# EAGLE design ethero_v3 (EAGLE 6.4)
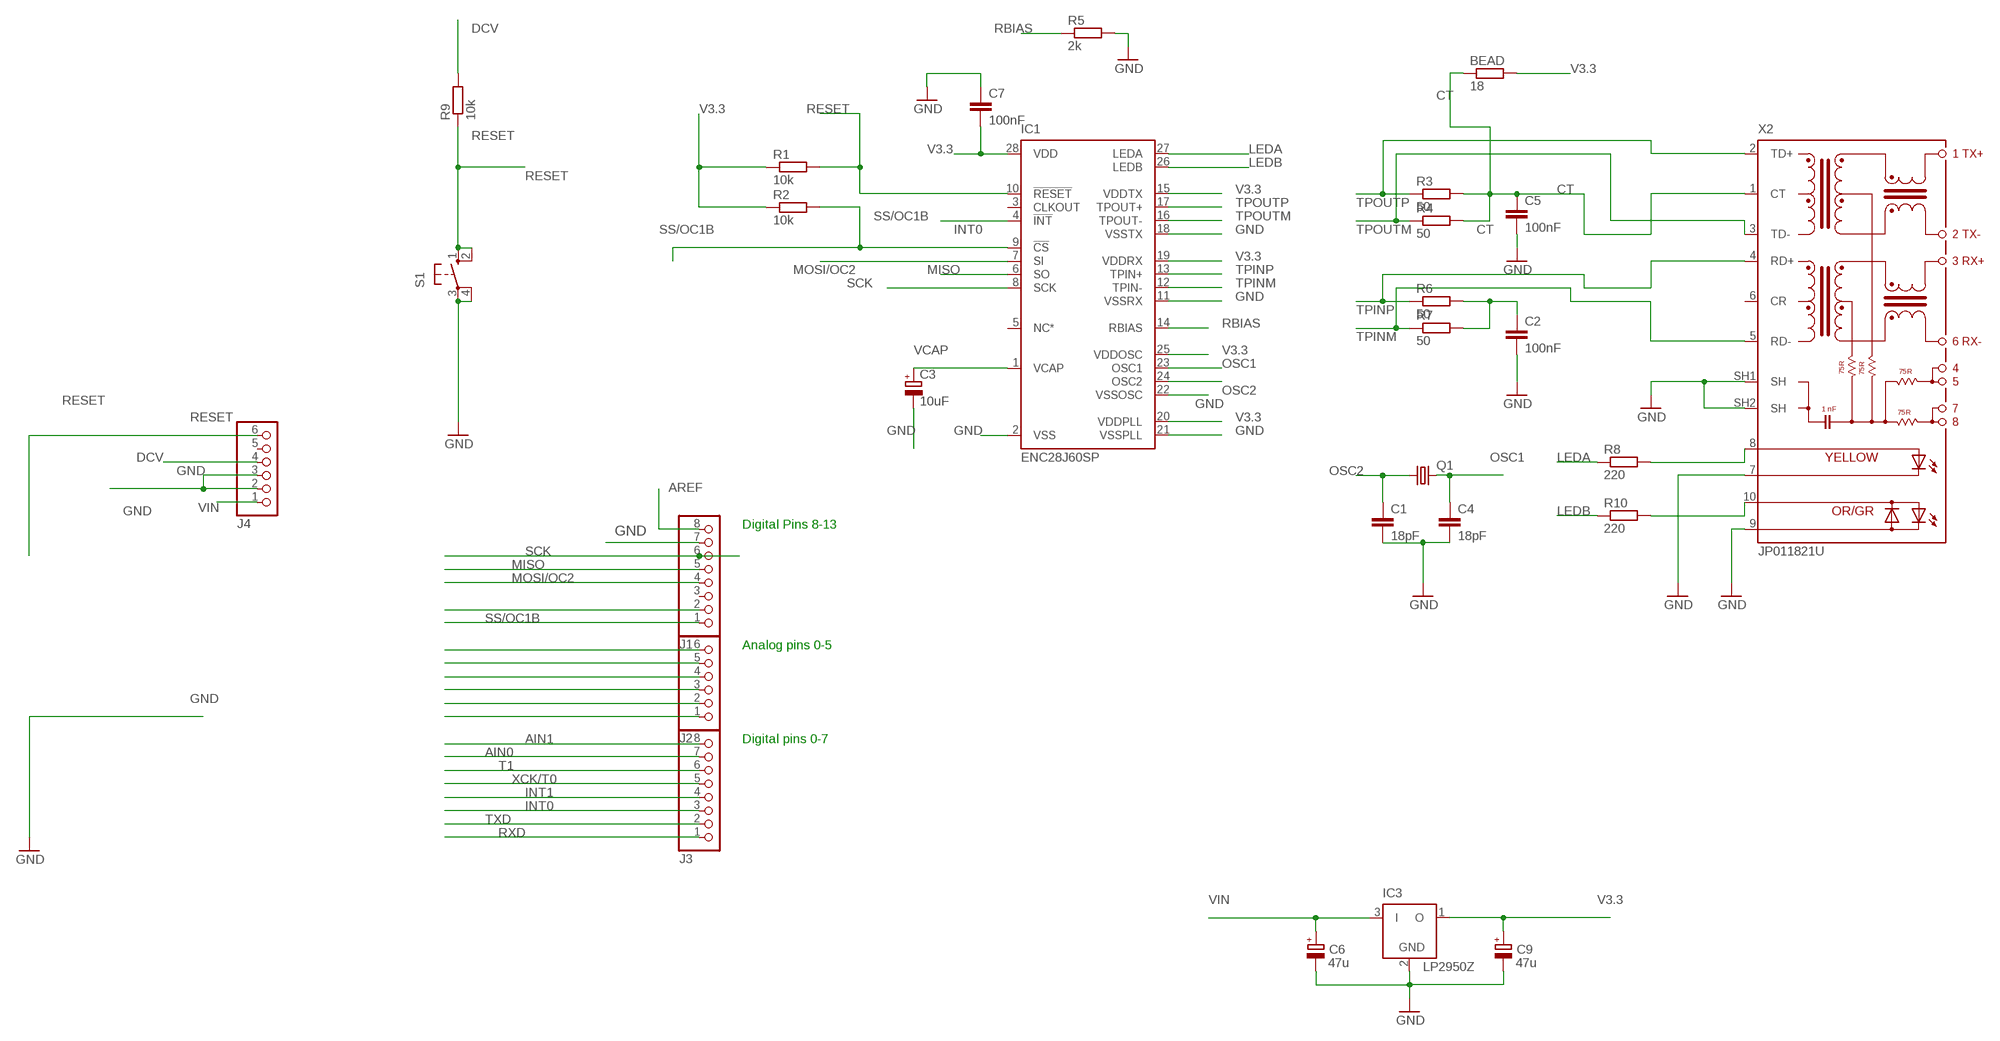
[diagram p0: schematic, sheet 1]

## Parts
BEAD  18  R-EU_0204/7  [0204/7]
C1  18pF  C-EU025-025X050  [C025-025X050]
C2  100nF  C-EU025-025X050  [C025-025X050]
C3  10uF  CPOL-EUE5-5  [E5-5]
C4  18pF  C-EU025-025X050  [C025-025X050]
C5  100nF  C-EU025-025X050  [C025-025X050]
C6  47u  CPOL-EUE3.5-8  [E3,5-8]
C7  100nF  C-EU025-025X050  [C025-025X050]
C9  47u  CPOL-EUE3.5-8  [E3,5-8]
IC1  ENC28J60SP  [DIL28-3]
IC3  LP2950Z  [TO92]
J1  PINHD-1X8  [1X08]
J2  PINHD-1X6  [1X06]
J3  PINHD-1X8  [1X08]
J4  PINHD-1X6  [1X06]
Q1  CRYSTALHC18U-V  [HC18U-V]
R1  10k  R-EU_0204/7  [0204/7]
R2  10k  R-EU_0204/7  [0204/7]
R3  50  R-EU_0204/7  [0204/7]
R4  50  R-EU_0204/7  [0204/7]
R5  2k  R-EU_0204/7  [0204/7]
R6  50  R-EU_0204/7  [0204/7]
R7  50  R-EU_0204/7  [0204/7]
R8  220  R-EU_0204/7  [0204/7]
R9  10k  R-EU_0204/7  [0204/7]
R10  220  R-EU_0204/7  [0204/7]
S1  10-XX  [B3F-10XX]
X2  JP011821U  [JP]

## Nets
AIN0: J3.7
AIN1: J3.8
AREF: J1.8
CT: BEAD.1 C5.1 R3.2 R4.2 X2.1(CT)
DCV [power]: J4.4 R9.2
GND [power]: C1.2 C2.2 C3.- C4.2 C5.2 C6.- C7.1 C9.- IC1.2(VSS) IC1.11(VSSRX) IC1.18(VSSTX) IC1.21(VSSPLL) IC1.22(VSSOSC) IC3.2(GND) J1.7 J4.2 J4.3 R5.2 S1.3(P) S1.4(P1) X2.7(C-Y) X2.9(A-O_C-G) X2.SH1(SH) X2.SH2(SH)
INT0: IC1.4(!INT) J3.3
INT1: J3.4
LEDA: IC1.27(LEDA) R8.1
LEDB: IC1.26(LEDB) R10.1
MISO: IC1.6(SO) J1.5
MOSI/OC2: IC1.7(SI) J1.4
N$2: J1.2
N$5: C2.1 R6.2 R7.2
N$10: R8.2 X2.8(A-Y)
N$12: R10.2 X2.10(C-O_A-G)
N$16: J2.1
N$17: J2.2
N$18: J2.3
N$19: J2.4
N$20: J2.5
N$21: J2.6
OSC1: C4.1 IC1.23(OSC1) Q1.2
OSC2: C1.1 IC1.24(OSC2) Q1.1
RBIAS: IC1.14(RBIAS) R5.1
RESET: IC1.10(!RESET) J4.6 R1.2 R9.1 S1.1(S) S1.2(S1)
RXD: J3.1
SCK: IC1.8(SCK) J1.6
SS/OC1B: IC1.9(!CS) J1.1 R2.2
T1: J3.6
TPINM: IC1.12(TPIN-) R7.1 X2.5(RD-)
TPINP: IC1.13(TPIN+) R6.1 X2.4(RD+)
TPOUTM: IC1.16(TPOUT-) R4.1 X2.3(TD-)
TPOUTP: IC1.17(TPOUT+) R3.1 X2.2(TD+)
TXD: J3.2
V3.3: BEAD.2 C7.2 C9.+ IC1.15(VDDTX) IC1.19(VDDRX) IC1.20(VDDPLL) IC1.25(VDDOSC) IC1.28(VDD) IC3.1(O) R1.1 R2.1
VCAP: C3.+ IC1.1(VCAP)
VIN [power]: C6.+ IC3.3(I) J4.1
XCK/T0: J3.5
Unconnected: IC1.3(CLKOUT) IC1.5(NC*) J1.3 J4.5 X2.6(CR)

## Notes on the sheet
- Digital Pins 8-13
- Analog pins 0-5
- Digital pins 0-7

## Library data of the parts
BEAD R1-R10 = resistor:R-EU_: RESISTOR, European symbol
C1 C2 C4 C5 C7 = resistor:C-EU: CAPACITOR, European symbol
C3 C6 C9 = rcl:CPOL-EU: POLARIZED CAPACITOR, European symbol
IC1 = microchip:ENC28J60: Stand-Alone Ethernet Controller with SPI Interface Source: http://ww1.microchip.com/downloads/en/DeviceDoc/39662c.pdf; MF: MICROCHIP; MPN: ENC28J60/SP; OC_FARNELL: 1084619; OC_NEWARK: 96K3661
IC3 = linear:LP2950: 100 mA, Low Power Low Dropout Voltage Regulator Source: http://www.onsemi.com/pub/Collateral/LP2950-D.PDF
J1 J3 = pinhead:PINHD-1X8: PIN HEADER
J2 J4 = pinhead:PINHD-1X6: PIN HEADER
Q1 = crystal:CRYSTAL: CRYSTAL; OC_FARNELL: unknown; OC_NEWARK: unknown
S1 = switch-omron:10-XX: OMRON SWITCH; MPN: B3F-1000; OC_FARNELL: 176432; OC_NEWARK: 36M3542
X2 = con-pulse:JP011821U: PULSEJACK (TM) 1x1 Tab-UP RJ45 10/100 Base-TX RJ45 1x1 Tab-UP with LEDs 8-pin (J1 series) and 6-pin (JP series) integrated magnetics connector, designed to support applications, such as ADSL modems, LAN-on-Motherboard, and Hub and Switches. Source: www.pulseeng.com .. PulseJack-J402.pdf; OC_FARNELL: unknown; OC_NEWARK: unknown

## Net classes
0 default: width 0.203 mm, clearance 0.203 mm
1 power: width 0.6 mm, clearance 0.305 mm
2 finepitch: width 0.203 mm, clearance 0.203 mm

## Board
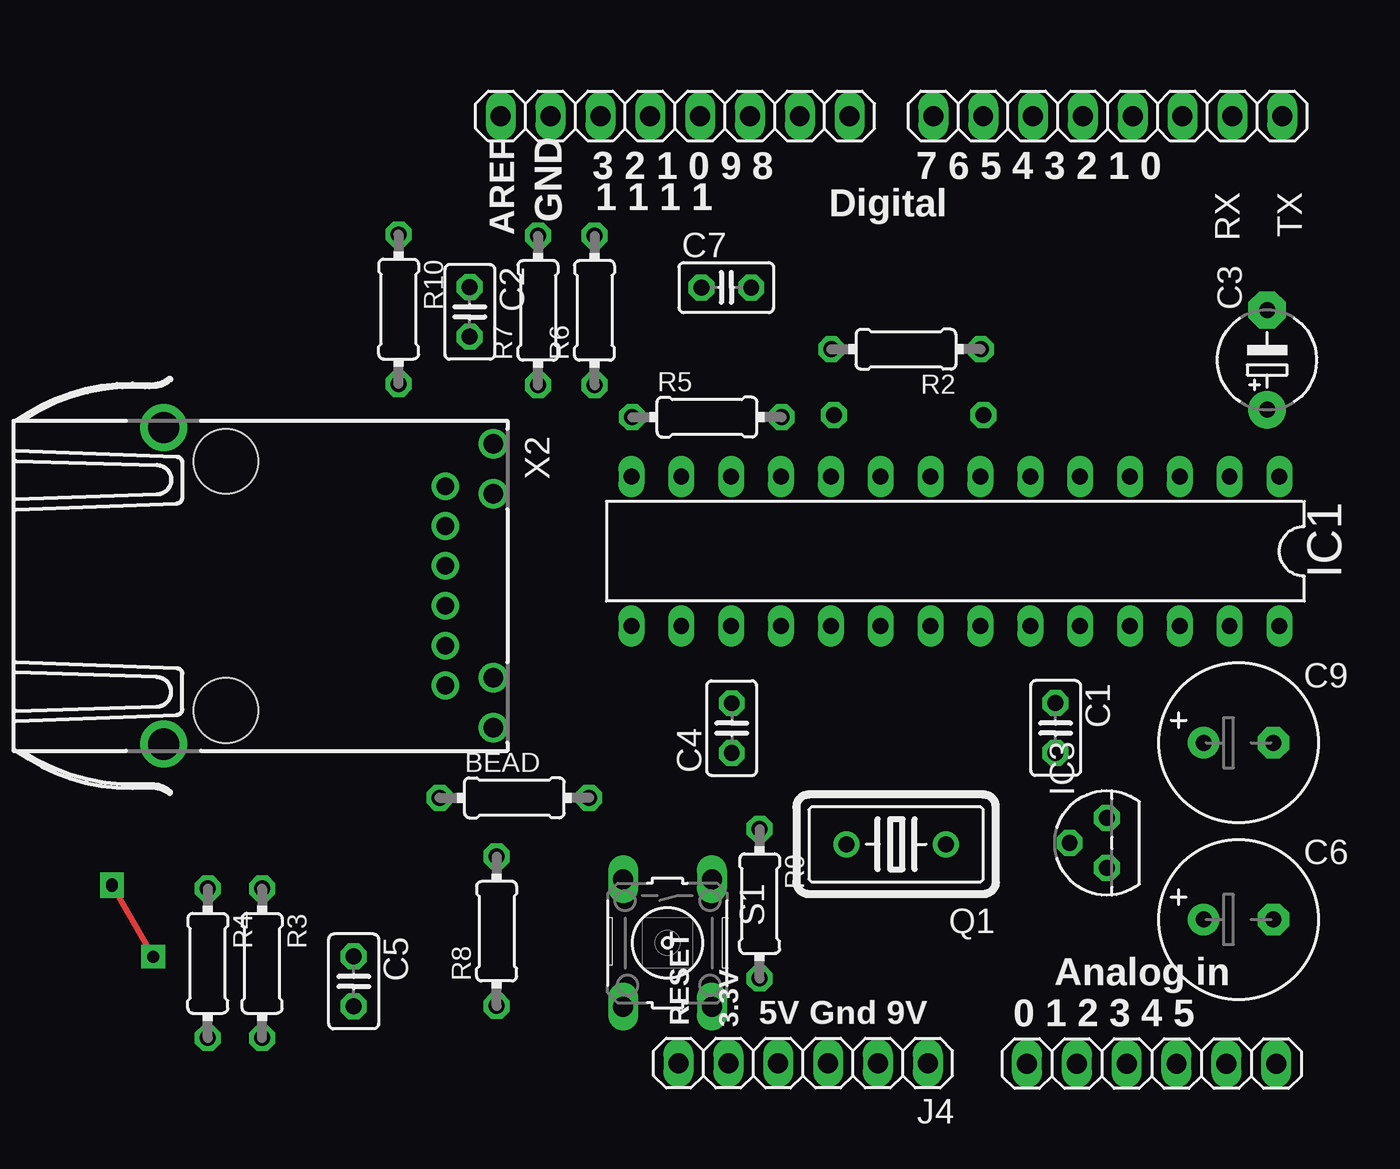
[diagram p1: board, top side]
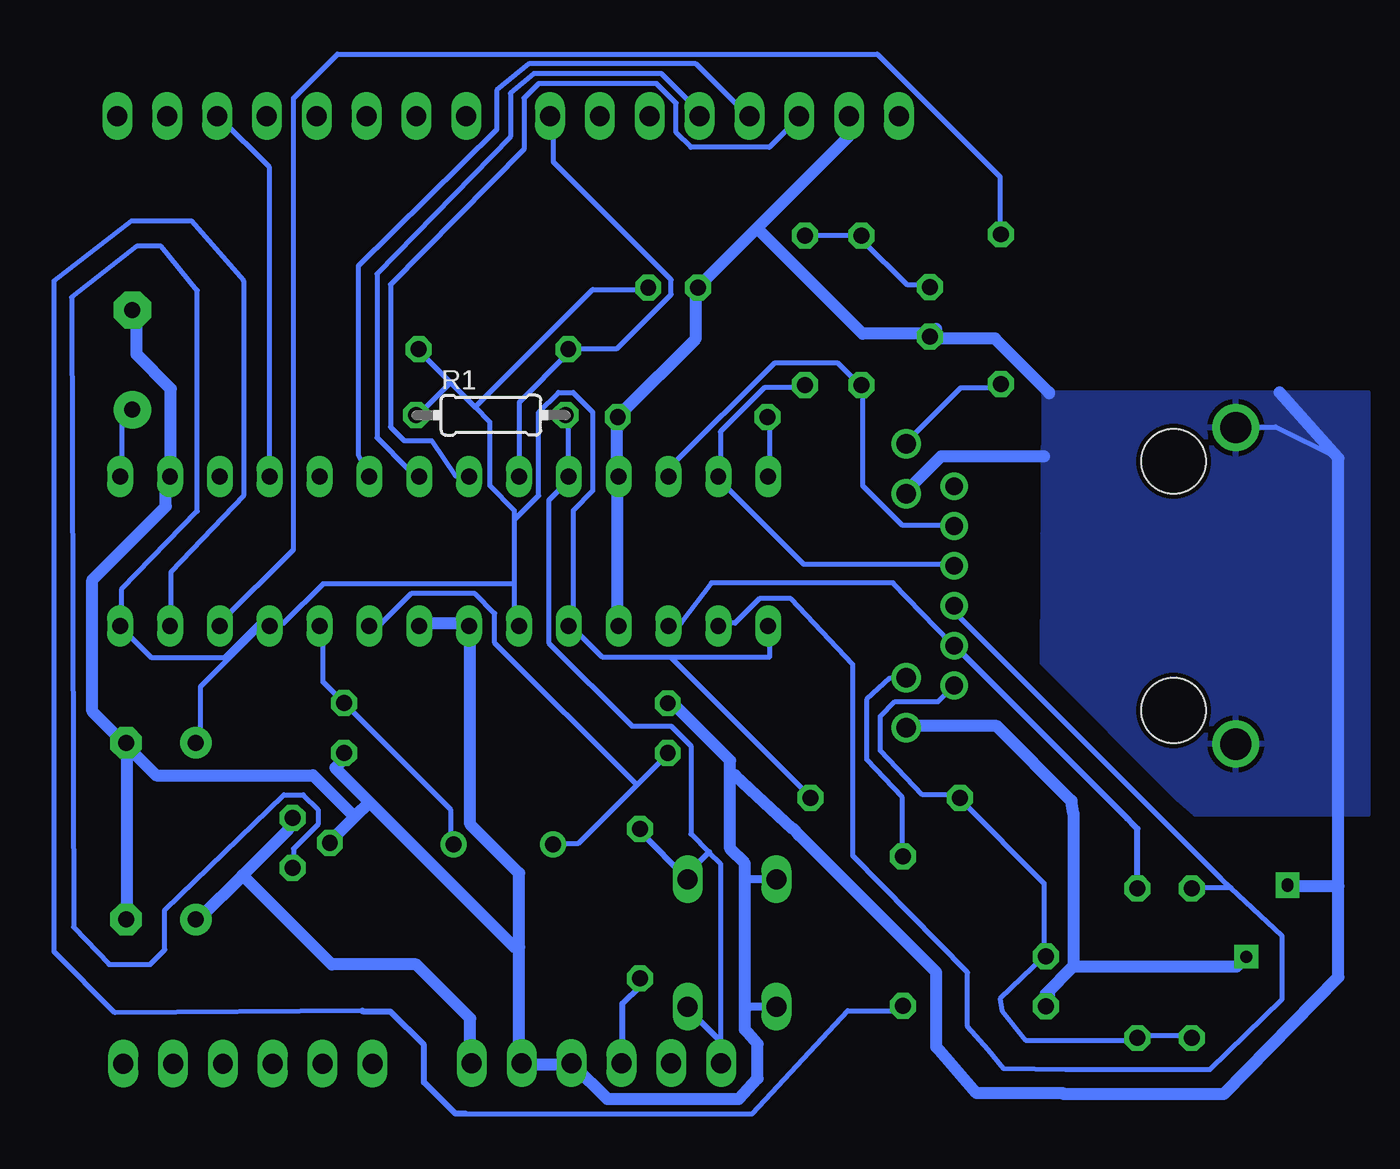
[diagram p2: board, bottom side, seen from below]

No outline drawn. Coordinates in mm, seen from the top.
Copper layers (1*16): Top 0.035mm / dielectric 1.5mm / Bottom 0.035mm
Design rules "default": minimum track width 10mil, minimum drill 0.6mm, track to track 8mil, track to pad 8mil, pad to pad 8mil, via to via 12mil, smd to smd 8mil, copper to edge 10mil, drill to drill 15mil, minimum pad ring 10mil, minimum via ring 12mil, stop-mask expansion 4mil, vias tented up to drill 0mil, thermal gap 10mil
tRestrict: area 13.4,48.9 to 17.2,52.7; area 64.2,33.6 to 68,37.4; area 64.2,5.7 to 68,9.5; 10 lines
bRestrict: area 13.4,48.9 to 17.2,52.7; area 64.2,33.6 to 68,37.4; area 64.2,5.7 to 68,9.5; 8 lines

### Footprints (pad centres in the part's own frame; a part is rotated, then mirrored left to right if it is on the bottom)
0204/7 = drill 0.813 octagon: 1 -3.81,0; 2 3.81,0
C025-025X050 = drill 0.813 octagon: 1 -1.27,0; 2 1.27,0
E5-5 = drill 0.813 pad 1.905: + -2.54,0 | drill 0.813 pad 1.905 octagon: - 2.54,0
E3,5-8 = drill 0.813 pad 1.6: + -1.778,0 | drill 0.813 pad 1.6 octagon: - 1.778,0
DIL28-3 = drill 0.813 long: 1 -16.51,-3.81; 2 -13.97,-3.81; 3 -11.43,-3.81; 4 -8.89,-3.81; 5 -6.35,-3.81; 6 -3.81,-3.81; 7 -1.27,-3.81; 8 1.27,-3.81; 9 3.81,-3.81; 10 6.35,-3.81; 11 8.89,-3.81; 12 11.43,-3.81; 13 13.97,-3.81; 14 16.51,-3.81; 15 16.51,3.81; 16 13.97,3.81; 17 11.43,3.81; 18 8.89,3.81; 19 6.35,3.81; 20 3.81,3.81; 21 1.27,3.81; 22 -1.27,3.81; 23 -3.81,3.81; 24 -6.35,3.81; 25 -8.89,3.81; 26 -11.43,3.81; 27 -13.97,3.81; 28 -16.51,3.81
TO92 = drill 0.813 octagon: 1 -1.27,0; 2 0,1.905; 3 1.27,0
1X08 = drill 1.016 long: 1 -8.89,0; 2 -6.35,0; 3 -3.81,0; 4 -1.27,0; 5 1.27,0; 6 3.81,0; 7 6.35,0; 8 8.89,0
1X06 = drill 1.016 long: 1 -6.35,0; 2 -3.81,0; 3 -1.27,0; 4 1.27,0; 5 3.81,0; 6 6.35,0
HC18U-V = drill 0.813: 1 -2.54,0; 2 2.54,0
B3F-10XX = drill 1.016 long: 1 -3.251,2.261; 2 3.251,2.261; 3 -3.251,-2.261; 4 3.251,-2.261
JP = drill 0.9 pad 1.3: 1 5.075,11.18; 2 3.045,11.18; 3 1.015,11.18; 4 -1.015,11.18; 5 -3.045,11.18; 6 -5.075,11.18 | drill 1 pad 1.4: 7 7.23,13.62; 8 4.69,13.62; 9 -4.69,13.62; 10 -7.23,13.62 | drill 1.6 pad 2.184: SH1 -8.065,-3.17; SH2 8.065,-3.17 | hole 3.3: 6.35,0; -6.35,0

### Placement (x,y rotation side)
BEAD  24.6,16.1 0 top
C1  52.18,19.65 270 top
C2  22.33,40.86 270 top
C3  62.96,38.41 90 top
C4  35.68,19.65 90 top
C5  16.41,6.74 270 top
C6  61.5,9.9 0 top
C7  35.4,42.1 0 top
C9  61.5,18.9 0 top
IC1  47.07,28.66 180 top
IC3  54.8,13.8 90 top
J1  32.79,50.84 180 top
J2  57.07,2.55 0 top
J3  54.84,50.84 180 top
J4  39.31,2.58 180 top
Q1  44.05,13.73 180 top
R1  44.69,35.6 0 bottom
R2  44.56,38.95 180 top
R3  11.74,7.67 270 top
R4  8.98,7.67 270 top
R5  34.41,35.5 0 top
R6  28.69,40.93 90 top
R7  25.81,40.93 90 top
R8  23.7,9.3 90 top
R9  37.1,10.7 270 top
R10  18.7,41 270 top
S1  32.4,8.7 270 top
X2  9.9,26.9 270 top

### Tracks (layer width: path | path; a pad name or v marks a point on that pad's centre or on a via)
CT
  Bottom 0.254: X2.1 21.25,21.75 21.15,21.75 21.9,21 24.1,21 24.85,20.25 24.85,18.5 22.7,16.25 21,16.25 BEAD.1 20.75,16 16.5,11.75 16.5,8.25 C5.1 16.5,8 18.75,5.85 18.65,5.25 17.45,3.75 11.75,3.75 R3.2 11.5,4 9,4 R4.2
DCV
  Bottom 0.305: R9.2 37.1,6.5 38,5.6 38,2.62 J4.4
GND  (via drill 0.6)
  Top 0.305: v4.1,11.6 v6.2,8
  Bottom 0.254: X2.SH1 5.74,34.97 5.7,35 4.7,35 1.5,33.4 | X2.7 22.07,19.67 22,19.6
  Bottom 0.406: S1.3 31.6,11.95 31.75,11.8 | S1.4 31.5,5.45 31.75,5.2
  Bottom 0.6: IC1.18 38.25,25 38.25,32.25 IC1.11 38.25,32.75 38.25,35.25 R5.2 38,35.75 34.25,39.5 34.25,42 C7.1 34,42.25 31.12,45.12 | 31.12,45.12 26.5,49.75 26.5,50.75 J1.7 | 15,15.3 15,7.5 16.25,6.25 16.25,5.5 C5.2 | C2.2 22.25,39.5 19,39.5 16.25,36.75 16.25,36.7 | 18.9,19.75 23.5,19.75 X2.7 | 16.5,33.5 21.75,33.5 23.5,31.75 X2.9 | 31.12,45.12 25.75,39.75 22.5,39.75 C2.2 | 61,32.5 IC1.2 | 61.25,32.25 IC1.2 | C1.2 52,18.25 52.62,17.62 50.88,15.88 | IC1.22 48.25,25 46,25 IC1.21 45.75,24.75 45.75,14.75 43.25,12.25 43.25,8.5 | 32.5,17.25 32.5,13.5 31.75,12.75 31.75,11.8 31.75,5.2 31.75,4.3 31.1,3.55 31.1,1.8 32.05,0.75 38.75,0.75 40.5,2.5 J4.3 40.75,2.5 43,2.5 J4.2 43.25,2.75 43.25,8.5 | 32.5,17.25 32.5,18 35.25,20.75 35.5,20.75 C4.2 | 50.88,15.88 43.5,8.5 43.25,8.5 | 32.5,17.25 32.25,17.25 29.35,14.55 29.25,14.5 29,14.2 22,7.2 22,3.4 19.95,1.05 15.55,1.05 15.5,1 7.35,1 1.5,6.95 1.5,11.6 1.5,33.4 4.5,36.75 | 22,40 22.25,39.75 C2.2 | 53,13.75 IC3.2 52.75,14 51.62,15.12 | 50.88,15.88 51.62,15.12 | 51.62,15.12 53.75,17.25 61.75,17.25 63.25,18.75 C9.- | C6.- 63.25,10 63.25,18.5 C9.- | IC1.2 61.25,32 61.25,30.95 65,27.2 65,20.5 63.5,19 C9.- | C3.- 62.75,40.75 62.75,38.7 61,36.95 61,32.75 IC1.2
  Bottom 0.61: 15,15.3 15.1,15.95 18.9,19.75 | C5.2 16.41,6.09 15,7.5 6.7,7.5 v6.2,8 | v4.1,11.6 1.5,11.6
  pour Bottom: 0,15.3 0,36.7 16.5,36.7 16.5,36.3 16.6,23 9.7,16.1 8.8,15.3
INT0
  Bottom 0.254: IC1.4 56,32.5 56,48.25 58.5,50.75 J3.3
LEDA
  Bottom 0.254: 46,0 31.35,0 26.5,5.25 23.75,5.25 R8.1 | 51.25,5.25 63.85,5.15 66.95,8.25 66.95,42.45 63,45.5 59.95,45.5 57.3,42.45 57.3,31.5 61,27.6 61,25 IC1.27
  Bottom 0.305: 46,0 46.5,0 48.1,1.6 48.1,3.5 49.8,5.2 51.2,5.2 51.25,5.25
LEDB
  Bottom 0.254: R10.1 18.75,45 18.75,47.75 25,54 52.5,54 54.75,51.75 54.75,28.75 58.5,25 IC1.26
MISO
  Bottom 0.254: IC1.6 51.45,33.6 51.45,43.2 44.4,50.15 44.4,52.15 42.75,53.5 34.25,53.5 31.75,51 J1.5
MOSI/OC2
  Bottom 0.254: IC1.7 48.5,32.5 48.9,32.85 50.5,34.45 50.5,42.8 43.7,49.8 43.7,52 42.5,53 36,53 34,51 J1.4
N$1  (via drill 0.6)
  other vias: 4.1,11.7
N$5
  Bottom 0.254: C2.1 22.5,42.25 23.5,42.25 25.75,44.5 R7.2 26,44.75 28.5,44.75 R6.2
N$10
  Bottom 0.254: X2.8 24.35,22.2 25.55,21.1 25.55,18.05 23.75,16.15 23.75,13.25 R8.2
N$12
  Bottom 0.254: R10.2 18.75,37 20.75,37 23.5,34.25 X2.10
OSC1
  Bottom 0.254: 37.25,16.75 35.75,18.25 C4.1 | 37.25,16.75 40.25,13.75 41.5,13.75 Q1.2 | 37.25,16.75 44.5,24 44.5,25.5 45.5,26.5 48.75,26.5 50.25,25 50.75,25 IC1.23
OSC2
  Bottom 0.254: Q1.1 46.75,13.75 46.75,15.5 52,20.75 C1.1 52.25,21 53.25,22 53.25,24.75 IC1.24
RBIAS
  Bottom 0.254: IC1.14 30.5,32.5 30.5,35.25 R5.1
RESET
  Bottom 0.254: R1.2 40.75,35.5 40.75,32.5 IC1.10 40.75,32.25 41.75,31.25 41.75,24 37.5,19.75 35.5,19.75 34.5,18.75 34.5,14.25 33.58,13.32 33,12.75 33,3.7 33,2.75 J4.6
  Bottom 0.305: 33.58,13.32 34.66,12.24 S1.1 37.1,14.39 R9.1 | S1.2 34.66,5.36 33,3.7
SCK
  Bottom 0.254: IC1.8 46,32.5 46.5,32.5 47.7,34.3 49.1,34.3 49.8,35 49.8,42.25 43,49.15 43,51.75 42.25,52.5 36.25,52.5 35.25,51.5 35.25,50 34.5,49.25 30.5,49.25 29,50.75 J1.6
SS/OC1B
  Bottom 0.254: IC1.9 43.25,32.5 43.25,36.25 40.75,38.75 R2.2 40.5,39 38.25,39 35.5,41.75 35.5,42.5 41.5,48.5 41.5,50.75 J1.1
TPINM
  Bottom 0.254: IC1.12 35.5,32.5 35.5,33 30.25,38.25 27,38.25 26,37.25 R7.1 25.75,37 25.75,32 23.75,30 21.25,30 X2.5
TPINP
  Bottom 0.254: R6.1 28.75,37 30.75,37 33,34.75 33,32.5 IC1.13 33,32.25 28.75,28 21.25,28 X2.4
TPOUTM
  Bottom 0.254: 6.98,11.52 7.5,12 21.25,25.75 X2.3 | 6.98,11.52 4.4,9.1 4.4,5.8 8.05,2.25 15.4,2.25 18.55,2.3 19.35,3.25 20.4,4.45 20.4,7.2 26.25,13.15 26.25,22.9 29.4,26.25 31,26.25 32.25,25 33,25 IC1.16 | R4.1 8.75,11.5 7,11.5 6.98,11.52
TPOUTP
  Bottom 0.254: IC1.17 35.5,25 35,25 33.45,27.05 24.2,27.05 21.25,24 X2.2
  Bottom 0.305: X2.2 12.26,15.04 12.04,14.82 11.74,14.52 R3.1
V3.3
  Bottom 0.254: IC1.15 30.5,24.75 30.5,23.25 35.5,23.25 | 35.5,23.25 39,23.25 40.5,24.75 IC1.19 40.5,25 40.5,30.75 39.5,31.75 39.5,35.75 40.5,36.75 41.25,36.75 42.25,35.75 42.25,31.5 43.5,30.25 | 56.5,24.75 56.25,24.75 | 56.25,24.75 56,24.75 IC1.25 | 56.25,24.75 IC1.25 | 43.5,30.25 43.5,30.75 44.75,32 44.75,35.25 45.5,36 | 43.5,30.25 43.5,27 | 43.5,27 43.5,25 IC1.20 | 46.75,37.25 48.25,38.75 R2.1 | 46.75,37.25 45.5,36 | 45.5,36 39.5,42 36.75,42 C7.2 | 46.75,37.25 48.25,35.75 R1.1 | 43.5,27 53.25,27 55.25,25 55.75,25 IC1.25 | 56.5,24.75 59.5,21.75 59.5,19 C9.+ | 56.5,24.75 IC1.25 | IC3.1 54.75,12.75 54.75,13.5 53.5,14.75 53.5,15.5 54.25,16.25 55.25,16.25 61.3,10.4 61.3,8.35 62.05,7.6 64.15,7.6 65.95,9.5 66.05,41.6 62.75,44.2 61.5,44.2 59.65,41.95 59.65,30.7 63.5,26.75 63.5,25 IC1.28 63.5,24.75 62,23.25 58.25,23.25 56.5,25 56,25 IC1.25 | 35.5,23.25 28.5,16.25 BEAD.2
VCAP
  Bottom 0.254: IC1.1 63.5,32.5 63.5,35.25 63,35.75 C3.+
VIN
  Bottom 0.6: 45.75,2.75 J4.1 | IC3.3 55,15 55,14.5 57.35,12.15 59.5,10 C6.+
  Bottom 0.61: 45.75,2.75 45.75,4.85 48.5,7.6 52.8,7.6 57.35,12.15

### Text on the board
tPlace: RESET | 3.3V
tNames: 3 2 1 0 9 8 | 7 6 5 4 3 2 1 0 | RX | TX | 1 1 1 1 | Digital | AREF | GND | Analog in | 5V Gnd 9V | 0 1 2 3 4 5
Edit History: 20070917 WestfW: Move (CC) symbol, use silk_gen to get 5mil widths | 20070917 WestfW: Manual route some, autoroute rest. Fiddle. | 20070917 WestfW: Now V1.16. Change components to TH. | 20070911 WestfW: Now V1.15. Move tracks slightly for shielding | 20070900 Daniel: Schematic and initial placement
_tsilk: C12 | C8 | 3 2 1 0 9 8 | 7 6 5 4 3 2 1 0 | RX | TX | 1 1 1 1 | Digital | X2 | AREF | GND | R7 | PWM | PWM | PWM | PWM | PWM | PWM | PWR | IC1 | 13 | Freeduino | FT232RL | c | c | R10 | V1.16 | TX | R8 | RX | 16Mhz | 1 | R1 | R9 | C3 | C10 | R12 | ]USB | R11 | ]EXT | F1 | Q1 | C2 | ICSP | RESET | 1 | CRS | M. Banzi | D. Cuartielles | D. Mellis | N. Zambetti | C5 | C4 | ATMEGA168 | IC2 | D1 | C1 | 47u | C7 | 47u | C6 | C9 | Analog in | 5V Gnd 9V | RESET | 3.3V | 0 1 2 3 4 5 | 9V in